# Altium schematic sheet RPL_POWER_BATTERY.SchDoc: Battery and Charger Breakouts
size A; Date: Dec 27, 2017; DrawnBy: Seyed Omid Hasanli; Revision: 1.0; SheetNumber: 12
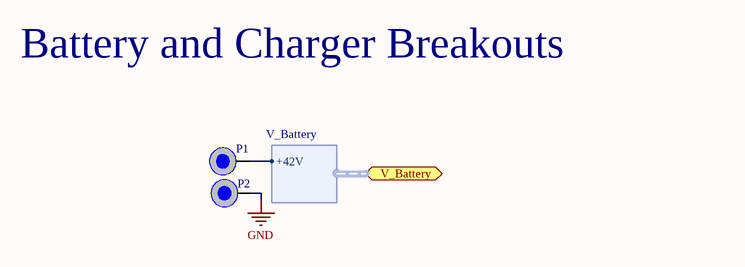
[diagram p0: RPL_POWER_BATTERY.SchDoc]

## Parts
P1  Single Port  [12AWG]  (value not drawn)
P2  Single Port  [12AWG]  (value not drawn)

## Ports
V_Battery (harness V_Battery)

## Harnesses
V_Battery: +42V

## Nets
GND: P2.1
NetP1_1: P1.1 ; port V_Battery.+42V

## Notes on the sheet
- Battery and Charger Breakouts
- Title:
- DrawnBy:
- Revision:
- SheetNumber:
- Date:
- Datasheet Link: